# Altium schematic sheet Frame.SchDoc
size A; SheetNumber: 7; SheetTotal: 7
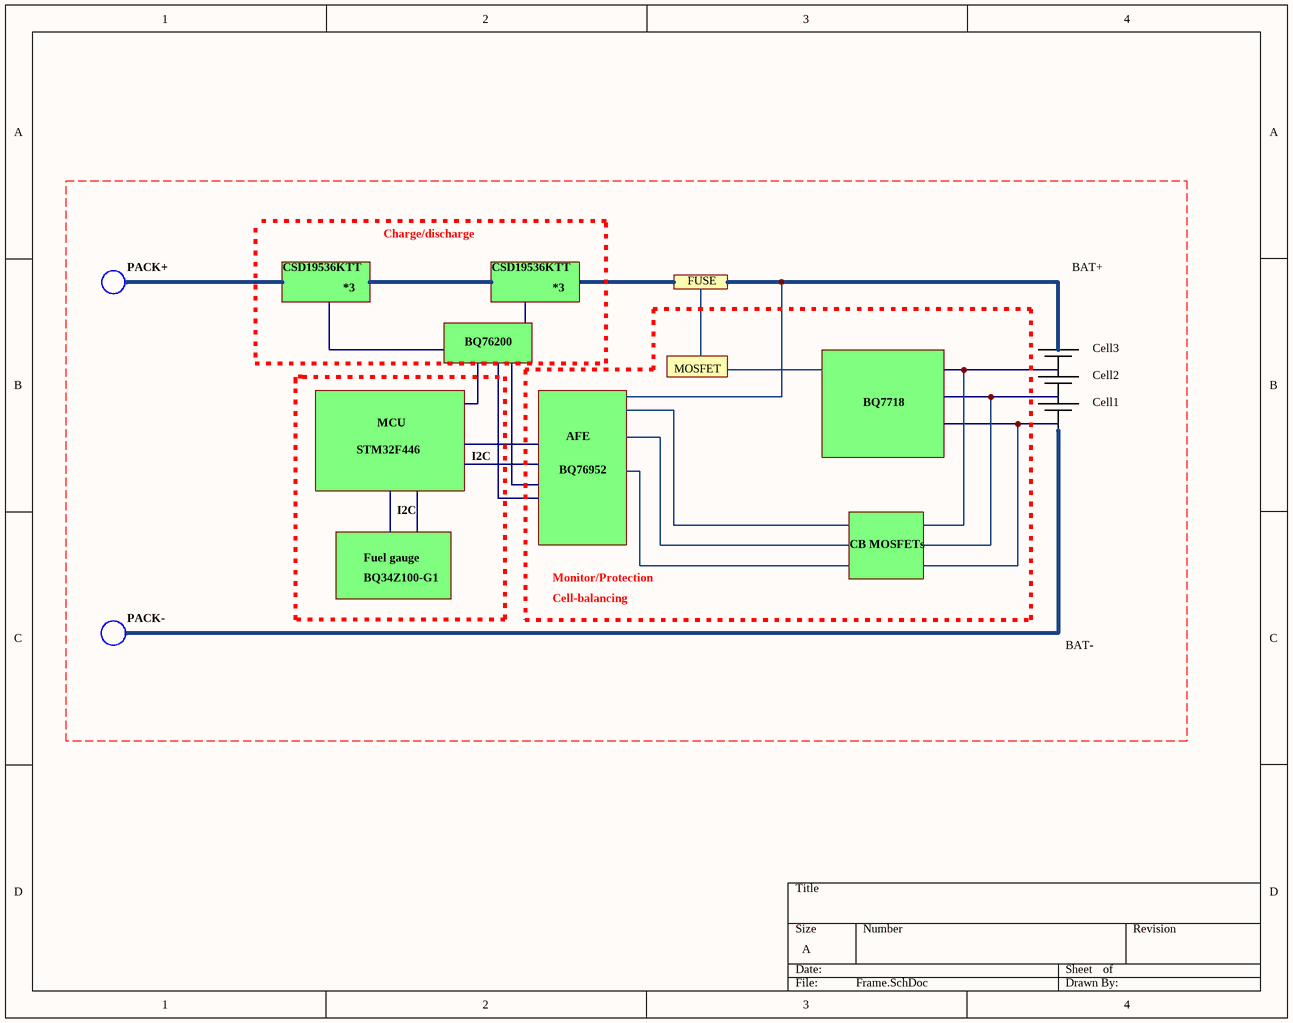
[diagram p0: Frame.SchDoc]

## Sub-sheets
BQ7718 = File Name: no entries
BQ76200 = File Name: no entries
BQ76952 = File Name: no entries
CB MOSFETs = File Name: no entries
CSD19536KTT = File Name: no entries
CSD19536KTT = File Name: no entries
Fuel gauge = File Name: no entries
STM32F446 = File Name: no entries

## Notes on the sheet
- Charge/discharge
- PACK+
- *3
- FUSE
- BAT+
- MOSFET
- Cell3
- MCU
- Cell1
- Cell2
- I2C
- AFE
- PACK-
- BQ34Z100-G1
- Monitor/Protection
- Cell-balancing
- BAT-